# Altium schematic sheet SoftCore_SA_P5.SchDoc: =ProjectTitle
size B; Engineer: Hab S Collector; Address1: 3621 Gin Way; Address2: Snellville GA, 30039; SheetNumber: 5; SheetTotal: 7
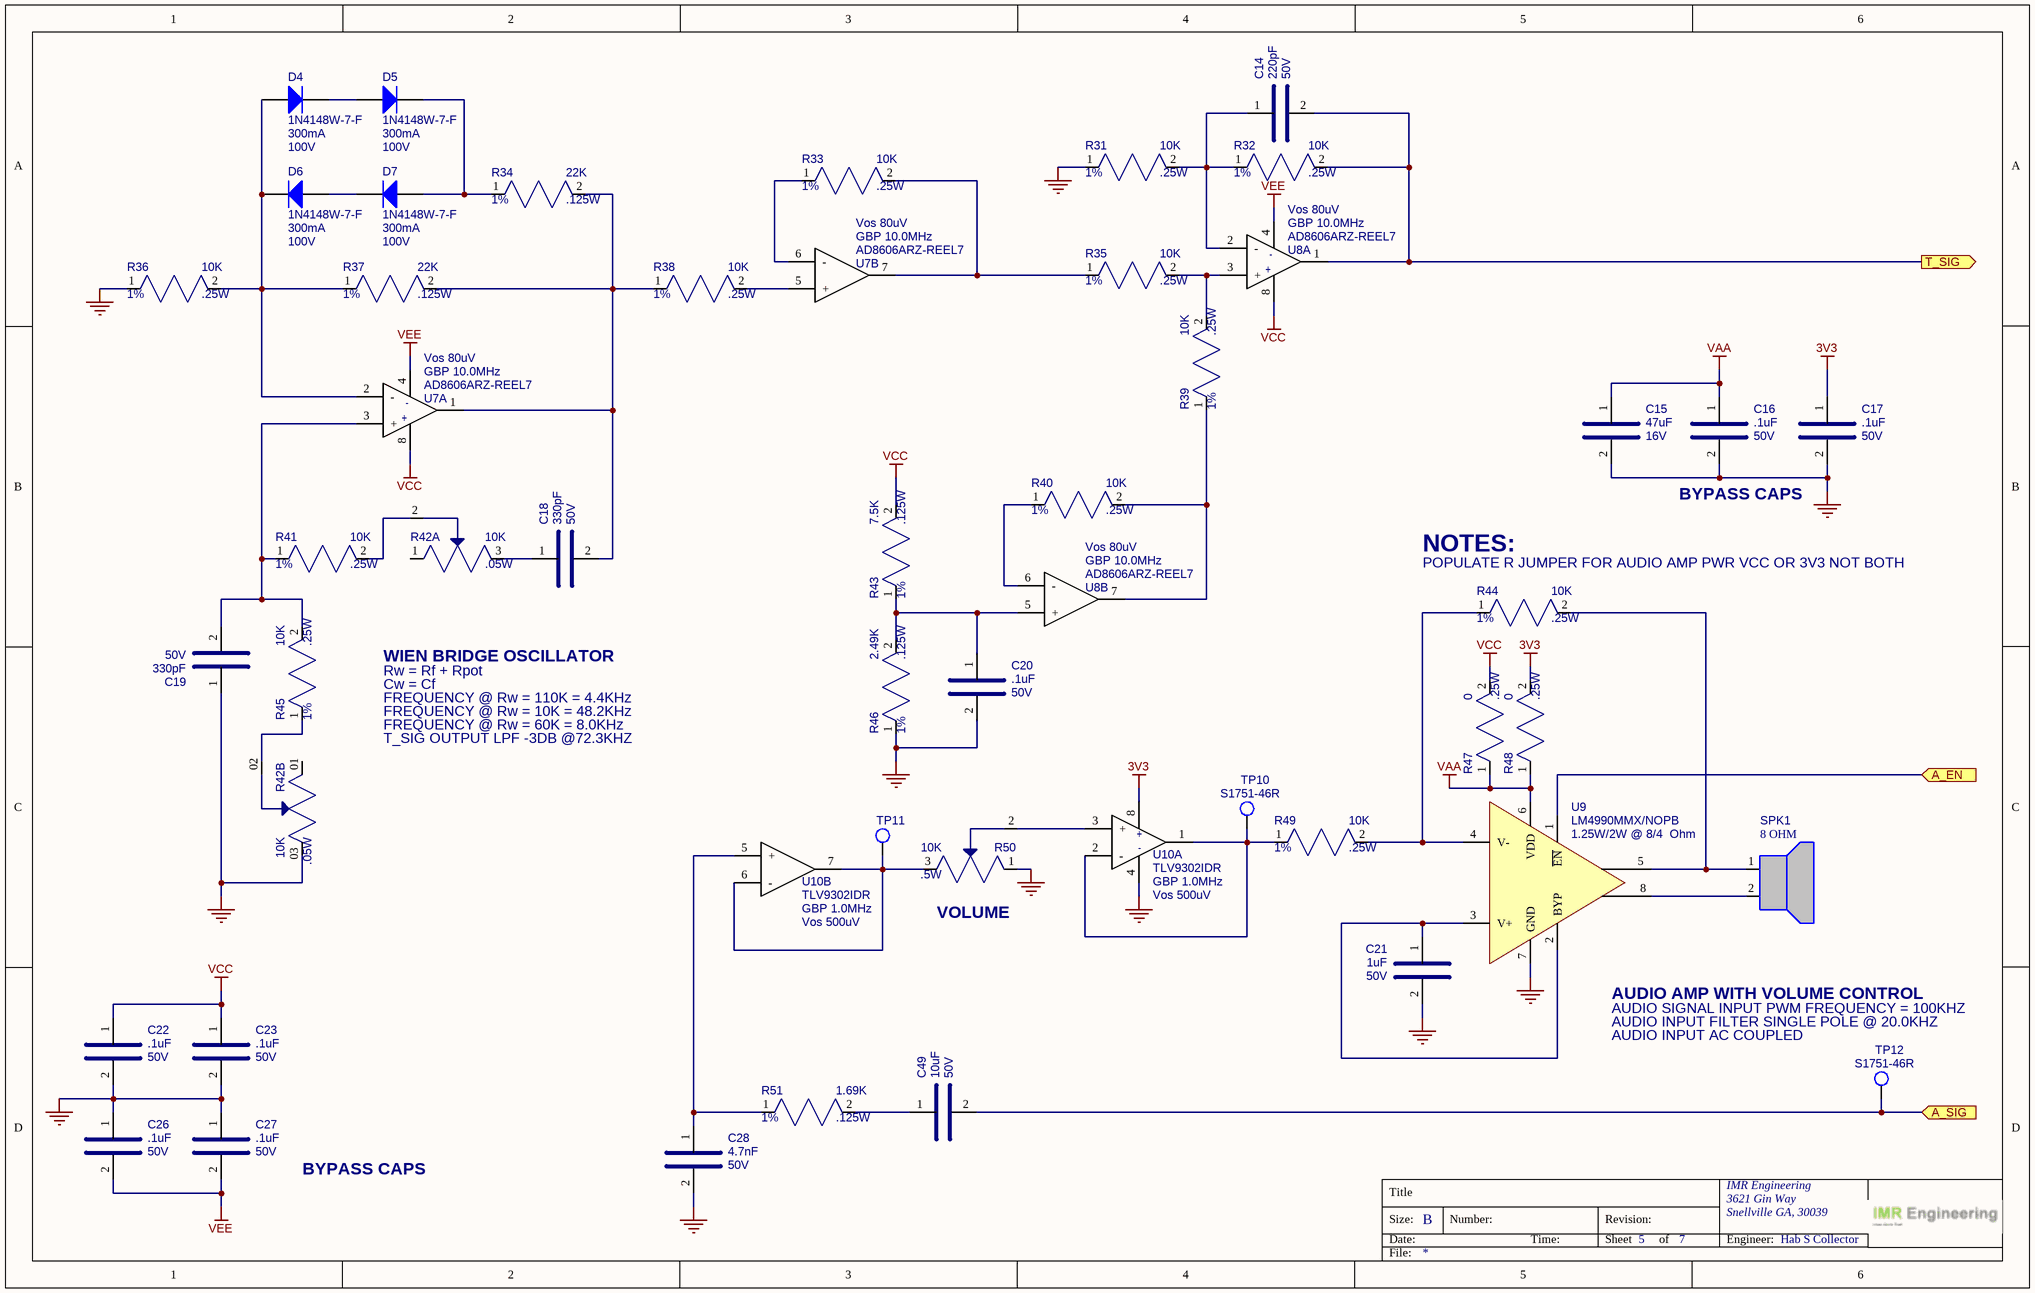
[diagram p0: SoftCore_SA_P5.SchDoc]

## Parts
C14  value 220pF  Voltage: 50V  [CAP_0805]  (hidden comment: CC0805JRNPO9BN221)
C15  value 47uF  Voltage: 16V  [CAP_1210]  (hidden comment: GRM32ER60J476ME20L)
C16  value .1uF  Voltage: 50V  [CAP_0805]  (hidden comment: KGM21NR71H104KT)
C17  value .1uF  Voltage: 50V  [CAP_0805]  (hidden comment: KGM21NR71H104KT)
C18  value 330pF  Voltage: 50V  [CAP_0805]  (hidden comment: CC0805JRNPO9BN331)
C19  value 330pF  Voltage: 50V  [CAP_0805]  (hidden comment: CC0805JRNPO9BN331)
C20  value .1uF  Voltage: 50V  [CAP_0805]  (hidden comment: KGM21NR71H104KT)
C21  value 1uF  Voltage: 50V  [CAP_0805]  (hidden comment: 08055C105K4T2A)
C22  value .1uF  Voltage: 50V  [CAP_0805]  (hidden comment: KGM21NR71H104KT)
C23  value .1uF  Voltage: 50V  [CAP_0805]  (hidden comment: KGM21NR71H104KT)
C26  value .1uF  Voltage: 50V  [CAP_0805]  (hidden comment: KGM21NR71H104KT)
C27  value .1uF  Voltage: 50V  [CAP_0805]  (hidden comment: KGM21NR71H104KT)
C28  value 4.7nF  Voltage: 50V  [CAP_0805]  (hidden comment: C0805C472K5RACAUTO)
C49  value 10uF  Voltage: 50V  [CAP_0805]  (hidden comment: GRM21BR61H106KE43L)
D4  value 100V  Current: 300mA  [SOD123]  (hidden comment: 1N4148W-7-F)
D5  value 100V  Current: 300mA  [SOD123]  (hidden comment: 1N4148W-7-F)
D6  value 100V  Current: 300mA  [SOD123]  (hidden comment: 1N4148W-7-F)
D7  value 100V  Current: 300mA  [SOD123]  (hidden comment: 1N4148W-7-F)
R31  value 10K  Power: .25W  Tolerance: 1%  [RES_0805]  (hidden comment: RC0805FR-7W10KL)
R32  value 10K  Power: .25W  Tolerance: 1%  [RES_0805]  (hidden comment: RC0805FR-7W10KL)
R33  value 10K  Power: .25W  Tolerance: 1%  [RES_0805]  (hidden comment: RC0805FR-7W10KL)
R34  value 22K  Power: .125W  Tolerance: 1%  [RES_0805]  (hidden comment: RC0805FR-0722KL)
R35  value 10K  Power: .25W  Tolerance: 1%  [RES_0805]  (hidden comment: RC0805FR-7W10KL)
R36  value 10K  Power: .25W  Tolerance: 1%  [RES_0805]  (hidden comment: RC0805FR-7W10KL)
R37  value 22K  Power: .125W  Tolerance: 1%  [RES_0805]  (hidden comment: RC0805FR-0722KL)
R38  value 10K  Power: .25W  Tolerance: 1%  [RES_0805]  (hidden comment: RC0805FR-7W10KL)
R39  value 10K  Power: .25W  Tolerance: 1%  [RES_0805]  (hidden comment: RC0805FR-7W10KL)
R40  value 10K  Power: .25W  Tolerance: 1%  [RES_0805]  (hidden comment: RC0805FR-7W10KL)
R41  value 10K  Power: .25W  Tolerance: 1%  [RES_0805]  (hidden comment: RC0805FR-7W10KL)
R42  value 10K  Power: .05W  [PRS12R-4]  (hidden comment: PRS12R-4115K-103B1)  (parts A,B of 2)
R43  value 7.5K  Power: .125W  Tolerance: 1%  [RES_0805]  (hidden comment: RC0805FR-077K5L)
R44  value 10K  Power: .25W  Tolerance: 1%  [RES_0805]  (hidden comment: RC0805FR-7W10KL)
R45  value 10K  Power: .25W  Tolerance: 1%  [RES_0805]  (hidden comment: RC0805FR-7W10KL)
R46  value 2.49K  Power: .125W  Tolerance: 1%  [RES_0805]  (hidden comment: RC0805FR-132K49L)
R47  value 0  Power: .25W  [RES_0805]  (hidden comment: RC0805JR-070RL)
R48  value 0  Power: .25W  [RES_0805]  (hidden comment: RC0805JR-070RL)
R49  value 10K  Power: .25W  Tolerance: 1%  [RES_0805]  (hidden comment: RC0805FR-7W10KL)
R50  value 10K  Power: .5W  [BOURNS_3386F]  (hidden comment: 3386P-1-103TLF)
R51  value 1.69K  Power: .125W  Tolerance: 1%  [RES_0805]  (hidden comment: RC0805FR-071K69L)
SPK1  value 8 OHM  [HDR_1X2_100MILL]  (hidden comment: TBD)
TP10  S1751-46R  [HARWIN_S1751]
TP11  (no value)  [TEST_POINT_20MIL_TH]  (no BOM)
TP12  S1751-46R  [HARWIN_S1751]
U7  value GBP 10.0MHz  Vos: Vos 80uV  [SOIC-8_54]  (hidden comment: AD8606ARZ-REEL7)  (parts A,B of 2)
U8  value GBP 10.0MHz  Vos: Vos 80uV  [SOIC-8_54]  (hidden comment: AD8606ARZ-REEL7)  (parts A,B of 2)
U9  value 1.25W/2W @ 8/4  Ohm  [SOP65P490X110-8N]  (hidden comment: LM4990MMX/NOPB)
U10  value GBP 1.0MHz  Vos: Vos 500uV  [SOIC-8_49]  (hidden comment: TLV9302IDR)  (parts A,B of 2)

## Ports
A_EN (in), A_SIG (in), T_SIG (out)

## Nets
3V3: C17.1 R48.2 U10.8
GND: C15.2 C16.2 C17.2 C19.1 C20.2 C21.2 C22.2 C23.2 C26.1 C27.1 C28.2 R31.1 R36.1 R42.03 R46.1 R50.1 U9.7(GND) U10.4
VAA: C15.1 C16.1 R47.1 R48.1 U9.6(VDD)
VCC: C22.1 C23.1 R43.2 R47.2 U7.8 U8.8
VEE: C26.2 C27.2 U7.4 U8.4
A_EN: U9.1(~{EN}) ; port A_EN
A_SIG: C49.2 TP12.1 ; port A_SIG
T_SIG: C14.2 R32.2 U8.1 ; port T_SIG
NetC14_1: C14.1 R31.2 R32.1 U8.2(-)
NetC18_1: C18.1 R42.3
NetC18_2: C18.2 R34.2 R37.2 R38.1 U7.1
NetC19_2: C19.2 R41.1 R45.2 U7.3(+)
NetC20_1: C20.1 R43.1 R46.2 U8.5(+)
NetC21_1: C21.1 U9.2(BYP) U9.3(V+)
NetC28_1: C28.1 R51.1 U10.5(+)
NetC49_1: C49.1 R51.2
NetD4_1: D4.1(A) D6.2(K) R36.2 R37.1 U7.2(-)
NetD4_2: D4.2(K) D5.1(A)
NetD5_2: D5.2(K) D7.1(A) R34.1
NetD6_1: D6.1(A) D7.2(K)
NetR33_1: R33.1 U7.6(-)
NetR33_2: R33.2 R35.1 U7.7
NetR35_2: R35.2 R39.2 U8.3(+)
NetR38_2: R38.2 U7.5(+)
NetR39_1: R39.1 R40.2 U8.7
NetR40_1: R40.1 U8.6(-)
NetR41_2: R41.2 R42.2
NetR42_02: R42.02 R45.1
NetR44_1: R44.1 R49.2 U9.4(V-)
NetR44_2: R44.2 SPK1.1 U9.5(VO1)
NetR49_1: R49.1 TP10.1 U10.1 U10.2(-)
NetR50_2: R50.2 U10.3(+)
NetR50_3: R50.3 TP11.1 U10.6(-) U10.7
NetSPK1_2: SPK1.2 U9.8(VO2)

Not connected (* = marked no-connect by the designer): R42 1 01

## Notes on the sheet
- BYPASS CAPS
- NOTES:
- (near R44) POPULATE R JUMPER FOR AUDIO AMP PWR VCC OR 3V3 NOT BOTH
- WIEN BRIDGE OSCILLATOR
- FREQUENCY @ Rw = 110K = 4.4KHz
- Rw = Rf + Rpot
- Cw = Cf
- FREQUENCY @ Rw = 10K = 48.2KHz
- FREQUENCY @ Rw = 60K = 8.0KHz
- T_SIG OUTPUT LPF -3DB @72.3KHZ
- (near R50) VOLUME
- (near U9) AUDIO AMP WITH VOLUME CONTROL
- AUDIO SIGNAL INPUT PWM FREQUENCY = 100KHZ
- AUDIO INPUT FILTER SINGLE POLE @ 20.0KHZ
- AUDIO INPUT AC COUPLED
- Title
- Size:
- Date:
- B
- Number:
- Time:
- Revision:
- Sheet
- of
- IMR Engineering
- Engineer:
- File:

## Library data of the parts
C14 = CAP_SMD_220PF_50V_0805: CAP CER 220PF 50V COG/NP0 0805; MFG: Yageo; Type: COG, NP0; Tolerance: 5%; Case/Package: 0805; MFG_PN: CC0805JRNPO9BN221; Supplier 1: DigiKey; Supplier Part Number 1: 311-1115-1-ND; Unit Price: .11
C15 = CAP_SMD_47UF_16V_1210: CAP CER 47UF 50V X5R 1210; MFG: Murata Electronics; Case/Package: 1210; MFG_PN: GRM32ER60J476ME20L; Supplier 1: DigiKey; Supplier Part Number 1: 490-1887-1-ND; Unit Price: .28
C16 C17 C20 C22 C23 C26 C27 = CAP_SMD_0.1UF_50V_0805: CAP CER 0.1UF 50V X7R 0805; MFG: KYOCERA AVX; Case/Package: 0805; MFG_PN: KGM21NR71H104KT; Supplier 1: DigiKey; Supplier Part Number 1: 478-KGM21NR71H104KTCT-ND; Unit Price: .1
C18 C19 = CAP_SMD_330PF_50V_0805: CAP CER 3300PF 50V COG/NP0 0805; MFG: Yageo; Type: COG, NP0; Tolerance: 5%; Case/Package: 0805; MFG_PN: CC0805JRNPO9BN331; Supplier 1: DigiKey; Supplier Part Number 1: 311-1117-1-ND; Unit Price: .11
C21 = CAP_SMD_1UF_50V_0805: CAP CER 1UF 50V X7R 0805; MFG: KYOCERA AVX; Case/Package: 0805; MFG_PN: 08055C105K4T2A; Supplier 1: DigiKey; Supplier Part Number 1: 478-KAM21KR71H105KUCT-ND; Unit Price: .27
C28 = CAP_SMD_4.7NF_50V_0805: CAP CER 4.7NF 50V X7R 0805; MFG: KEMET; Case/Package: 0805; MFG_PN: C0805C472K5RACAUTO; Supplier 1: DigiKey; Supplier Part Number 1: 399-6969-1-ND; Unit Price: .12
C49 = CAP_SMD_10UF_50V_0805: CAP CER 10UF 50V X5R 0805; MFG: Murata Electronics; Case/Package: 0805; MFG_PN: GRM21BR61H106KE43L; Supplier 1: DigiKey; Supplier Part Number 1: 490-18663-1-ND; Unit Price: .28
D4-D7 = DIODE_1N4148W-7-F: RELAY REED SPDT 250MA 5V; MFG: Diodes Inc; Case/Package: SOD-123; Supplier 1: DigiKey; Supplier Part Number 1: 1N4148W-FDICT-ND; Unit Price: .16; MFG_PN: 1N4148W-7-F
R31-R33 R35 R36 R38-R41 R44 R45 R49 = RES_SMD_10K_0805_1/4W_1%: RES SMD 10K OHM 1% 1/4W 0805; MFG: Yageo; Case/Package: 0805; MFG_PN: RC0805FR-7W10KL; Supplier 1: DigiKey; Supplier Part Number 1: 13-RC0805FR-7W10KLCT-ND; Unit Price: .10
R34 R37 = RES_SMD_22K_0805_1/8W_1%: RES SMD 22K OHM 1% 1/8W 0805; MFG: Yageo; Case/Package: 0805; MFG_PN: RC0805FR-0722KL; Supplier 1: DigiKey; Supplier Part Number 1: 311-22.0KCRCT-ND; Unit Price: .10
R42 = RES_POT_10K_2XGANG_LINEAR: POT 10K OHM 1/20W LINEAR - 2X GANG; MFG: Bourns Inc.; Case/Package: PRS12R-4; MFG_PN: PRS12R-4115K-103B1; Supplier 1: DigiKey; Supplier Part Number 1: 118-PRS12R-4115K-103B1-ND; Unit Price: 2.56
R43 = RES_SMD_7.5K_0805_1/8W_1%: RES SMD 7.5K OHM 1% 1/8W 0805; MFG: Yageo; Case/Package: 0805; MFG_PN: RC0805FR-077K5L; Supplier 1: DigiKey; Supplier Part Number 1: 311-7.50KCRCT-ND; Unit Price: .10
R46 = RES_SMD_2.49K_0805_1/8W_1%: RES SMD 2.49K OHM 1% 1/8W 0805; MFG: Yageo; Case/Package: 0805; MFG_PN: RC0805FR-132K49L; Supplier 1: DigiKey; Supplier Part Number 1: 13-RC0805FR-132K49LCT-ND; Unit Price: .1
R47 R48 = RES_SMD_0_0805_1/8W_1%: RES SMD 0 OHM 1% 1/8W 0805; MFG: Yageo; Case/Package: 0805; MFG_PN: RC0805JR-070RL; Supplier 1: DigiKey; Supplier Part Number 1: 311-0.0ARCT-ND; Unit Price: .1; Tolerance: 1%
R50 = RES_POT_10K_1XGANG_LINEAR: POT 10K OHM 1/20W LINEAR - 1X GANG; MFG: Bourns Inc.; Case/Package: PRS12R-4; MFG_PN: 3386P-1-103TLF; Supplier 1: DigiKey; Supplier Part Number 1: 3386P-103TLF-ND; Unit Price: 2.20
R51 = RES_SMD_1.69K_0805_1/8W_1%: RES SMD 1.69K OHM 1% 1/8W 0805; MFG: Yageo; Case/Package: 0805; MFG_PN: RC0805FR-071K69L; Supplier 1: DigiKey; Supplier Part Number 1: 311-1.69KCRCT-ND; Unit Price: .1
SPK1 = CONN_SPKR_HEADER_2P_100MIL: CONN SPEAKER HEADER GENERIC VERT 2POS 2.54MM; Case/Package: 2P_2.54MM; MFG: GENERIC; Supplier 1: Digi-Key; Supplier Part Number 1: TBD; Unit Price: 1.00; MFG_PN: TBD
TP10 TP12 = CONN_TEST_POINT_S1751-46R: PCB TEST POINT CONNECT; MFG: Harwin Inc; Case/Package: S1751; Supplier 1: Digi-Key; Supplier Part Number 1: 952-1478-1-ND; Value: *; Unit Price: .28; MFG_PN: S1751-46R
TP11 = CONN_TEST_POINT_TH_PAD_20MIL: TEST POINT TH 20MIL HOLE
U7 U8 = IC_OPAMP_AD8606ARZ-REEL7: IC OPAMP GP 2 CIRCUIT 8SOIC; MFG: Analog Devices; Unit Price: 4.94; Package/Case: SOIC-8; Supplier 1: DigiKey; Supplier Part Number 1: AD8606ARZ-REEL7CT-ND; MFG_PN: AD8606ARZ-REEL7
U9 = IC_LM4990MMX/NOPB: IC AMP CLASS AB MONO 2W 8VSSOP; MFG: Texas Instruments; Case/Package: SC-70-6; Supplier 1: DigiKey; Supplier Part Number 1: 296-37579-1-ND; Unit Price: .45; MFG_PN: LM4990MMX/NOPB
U10 = IC_OPAMP_TLV9302IDR: IC OPAMP GP 2 CIRCUIT 8SOIC; MFG: Texas Instruments; Unit Price: .66; Package/Case: SOIC-8; Supplier 1: DigiKey; Supplier Part Number 1: 296-53513-1-ND; MFG_PN: TLV9302IDR